# EasyEDA Pro project ProPrj_大功率电调_2026-08-17.epro, board 主控板
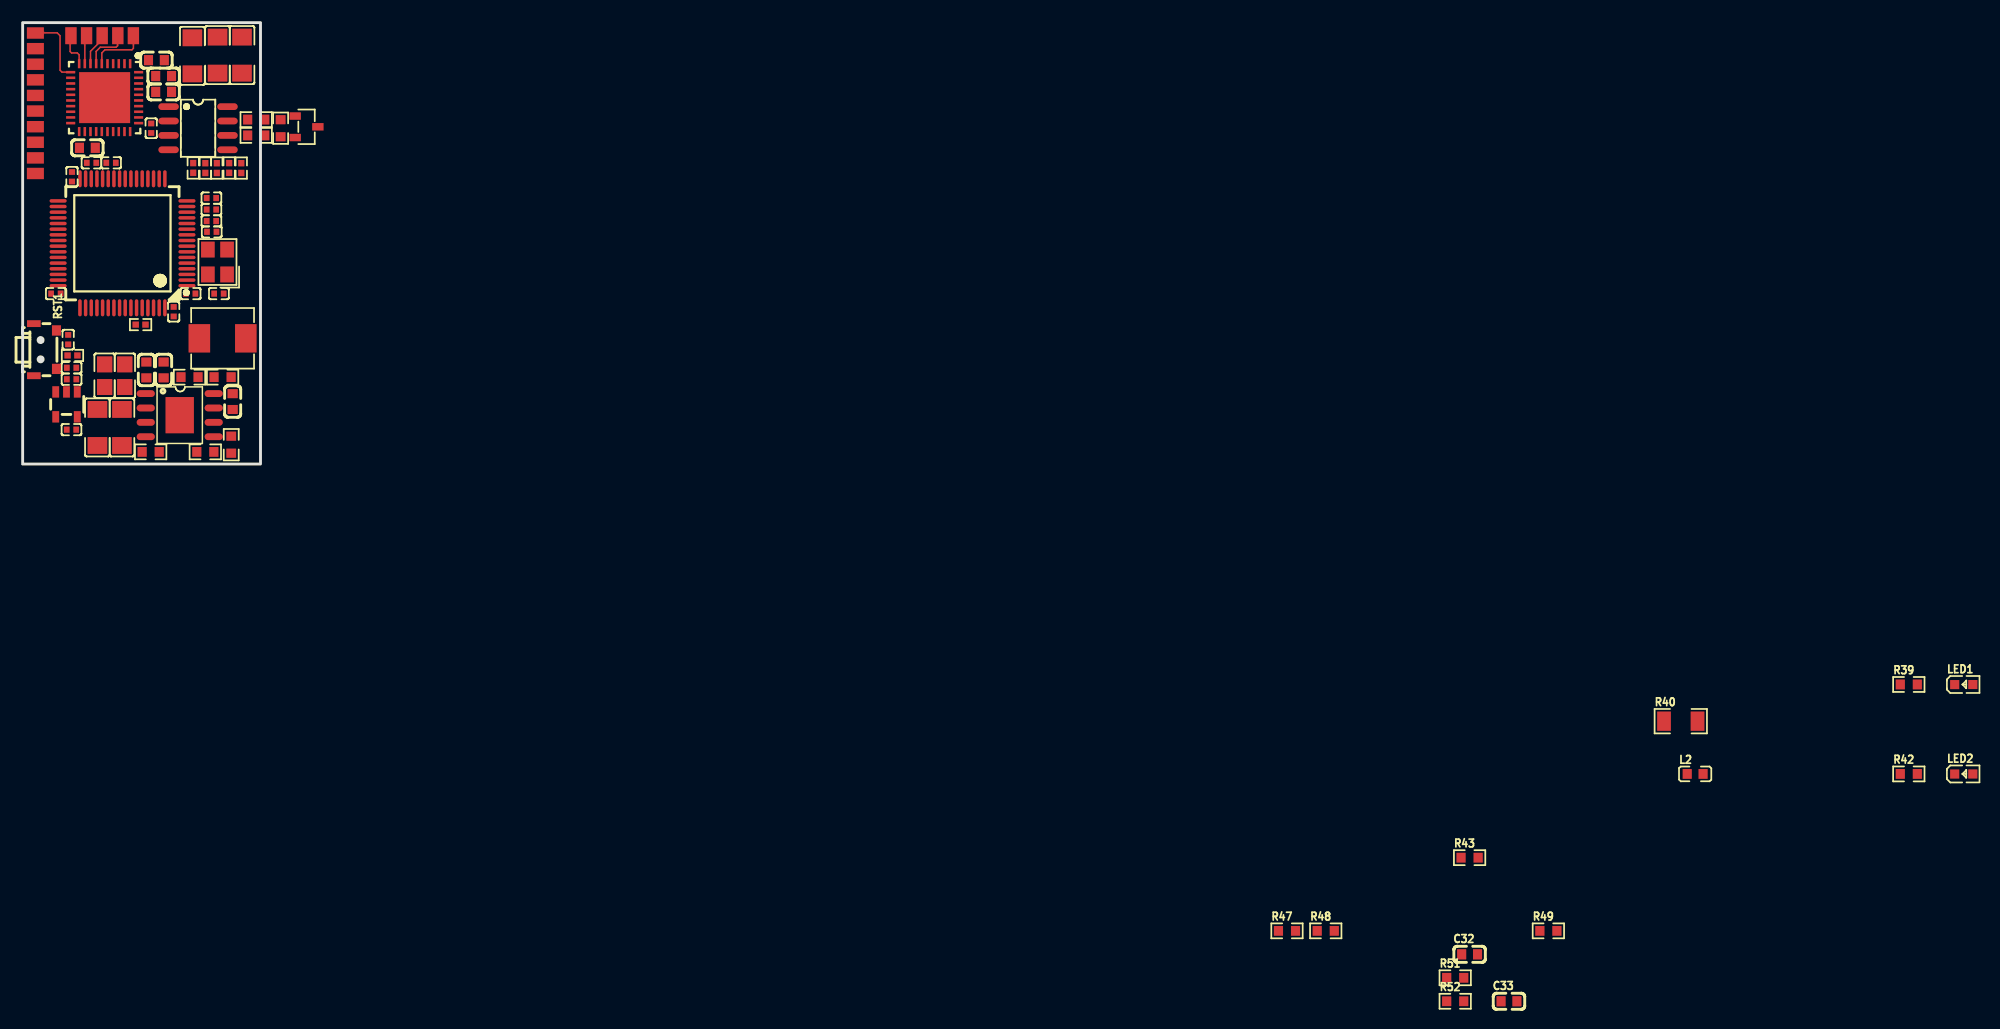
[diagram p25: board, top side]
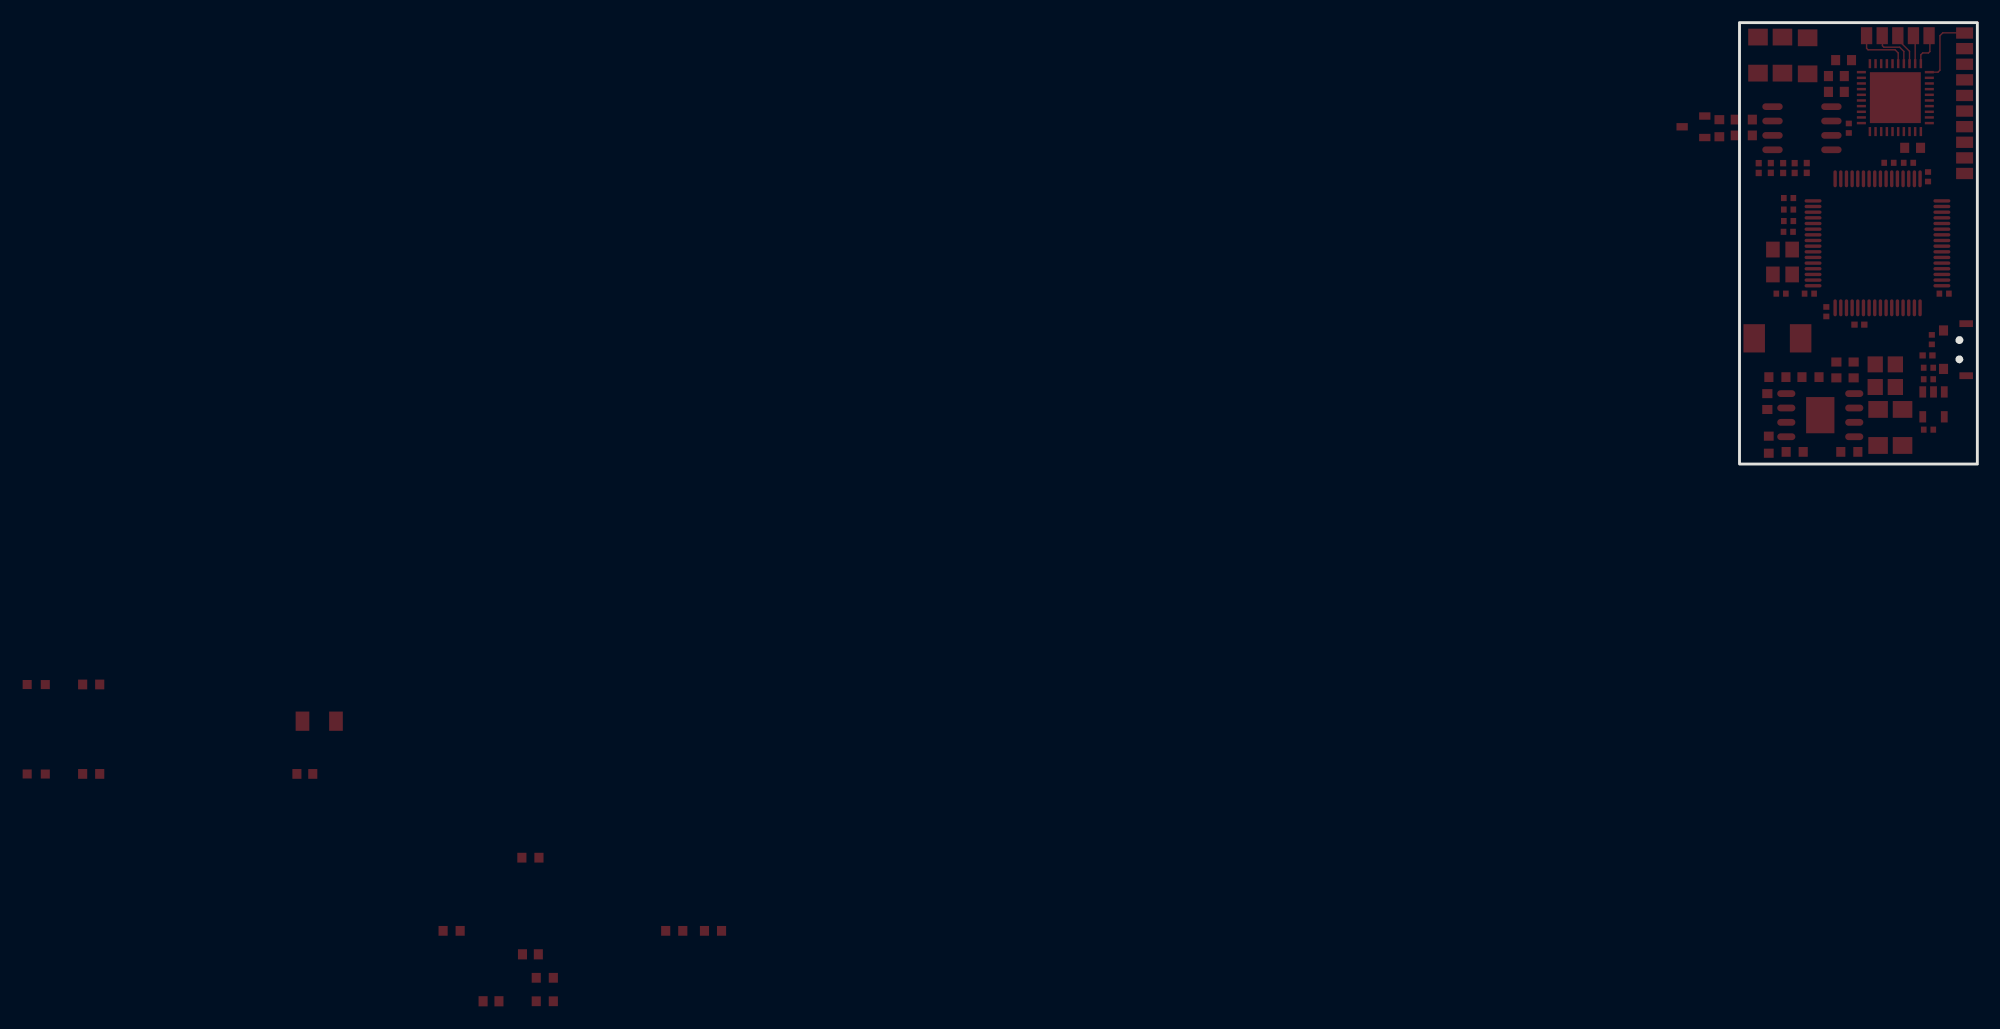
[diagram p26: board, bottom side, seen from below]

Outline 21 x 39 mm; copper layers: Top Layer, Bottom Layer. Coordinates in mm from the lower left corner of the outline.
Outline path: rectangle 0,39 21,0
Stack: Top Layer 0.035mm / Dielectric1 1.51mm FR4 er 4.5 / Bottom Layer 0.035mm

## Design rules (mm)
spacing copperThickness1oz (default): track to track 0.102, other pairs 0.152 to 0.3
spacing copperThickness2oz: track to track 0.203, other pairs 0.152 to 0.3
track width copperThickness1oz (default): min 0.127, default 0.127, max 2.54
track width copperThickness2oz: min 0.203, default 0.254, max 2.54
differential pair differentialPair (default): width min 0.127, default 0.254, max 2.54; gap min 0.152, default 0.152

## Placement (name value [footprint] x y rotation side)
C1  47nf  [C0603]  11.81 35.69 180 top
C2  10uF/100v  [C1206]  19.37 36.13 90 top
C3  100nF/100v  [C1206]  17.21 36.13 90 top
C4  1uF  [C1206]  14.99 36.07 270 top
C5  1uf  [C0603]  12.45 34.28 0 top
C6  1uf  [C0603]  12.45 32.88 0 top
C7  1nF  [C0402]  16.67 23.5 180 top
C8  1nF  [C0402]  16.67 22.49 180 top
C9  1nF  [C0402]  16.67 21.47 180 top
C10  2.2nF/50v  [C0603]  18.54 5.52 90 top
C11  22µF/16V  [C0805]  7.24 7.81 90 top
C12  22µF/16V  [C0805]  9.02 7.81 90 top
C13  2.2uf/100v  [C1206]  6.6 3.23 270 top
C14  100nF/100v  [C1206]  8.76 3.23 270 top
C15  3.3nf/50v  [C0603]  12.45 8.31 270 top
C16  150pf/50v  [C0603]  10.92 8.31 270 top
C17  1uF  [C0402]  4.32 8.51 0 top
C18  100nF  [C0402]  4.32 7.49 0 top
C19  1uF  [C0402]  4.31 3.04 0 top
C20  20pf  [C0402]  16.69 20.52 0 top
C21  100nF  [C0402]  13.34 13.46 90 top
C22  100nF  [C0402]  14.83 15.06 180 top
C23  100nF  [C0402]  2.93 15.06 0 top
C24  100nF  [C0402]  4.35 25.38 270 top
C25  100nF  [C0402]  6.08 26.61 0 top
C26  1uf  [C0603]  5.72 27.94 0 top
C27  100nF  [C0402]  7.8 26.61 180 top
C28  20pf  [C0402]  17.33 15.06 180 top
C29  100nF  [C0402]  4.02 10.99 270 top
C30  100nF  [C0402]  11.35 29.67 90 top
C32  10nF  [C0603]  127.76 -43.31 0 top
C33  100nF  [C0603]  131.23 -47.46 0 top
D1  PESD2CAN,215  [SOT-23-3_L2.9-W1.3-P1.90-LS2.4-BR]  25.06 29.8 180 top
L1  33uH  [IND-SMD_L5.4-W5.2]  17.65 11.11 0 top
L2  BLM18PG121SN1D  [L0603]  147.67 -27.38 0 top
LED1  -  [LED_0603]  171.44 -19.47 0 top
LED2  -  [LED_0603]  171.44 -27.38 0 top
NOREF  -  [Pad_e283]  1.12 36.7 90 top
NOREF#2  -  [Pad_e281]  1.12 33.95 90 top
NOREF#3  -  [Pad_e289]  1.12 28.43 90 top
NOREF#4  -  [Pad_e284]  1.12 29.81 90 top
NOREF#5  -  [Pad_e276]  8.4 37.85 0 top
NOREF#6  -  [Pad_e285]  1.12 31.19 90 top
NOREF#7  -  [Pad_e282]  1.12 35.32 90 top
NOREF#8  -  [Pad_e278]  1.12 38.08 90 top
NOREF#9  -  [Pad_e275]  9.78 37.85 0 top
NOREF#10  -  [Pad_e280]  5.64 37.85 0 top
NOREF#11  -  [Pad_e288]  1.12 27.05 90 top
NOREF#12  -  [Pad_e286]  1.12 32.57 90 top
NOREF#13  -  [Pad_e277]  7.02 37.85 0 top
NOREF#14  -  [Pad_e287]  1.12 25.67 90 top
NOREF#15  -  [Pad_e279]  4.26 37.85 0 top
R1  10K  [R0402]  4.4 9.6 180 top
R28  10K  [R0402]  19.3 26.15 90 top
R29  10K  [R0402]  18.24 26.16 90 top
R30  100  [R0402]  17.15 26.15 90 top
R31  100  [R0402]  16.13 26.15 90 top
R32  100  [R0402]  15.06 26.16 90 top
R33  68K  [R0603]  17.65 7.68 0 top
R34  158k  [R0603]  18.42 1.71 270 top
R35  68K  [R0603]  14.73 7.68 0 top
R36  49.9k  [R0603]  16.13 1.08 0 top
R37  31.6k  [R0603]  11.3 1.08 180 top
R38  10K  [R0402]  10.41 12.32 0 top
R39  10K  [R0603]  166.54 -19.47 0 top
R40  0  [R1206]  146.4 -22.72 0 top
R42  10K  [R0603]  166.54 -27.38 0 top
R43  100  [R0603]  127.76 -34.78 0 top
R44  5.1  [R0603]  20.62 30.43 0 top
R46  120  [R0603]  22.78 29.67 90 top
R47  330K  [R0603]  111.63 -41.24 0 top
R48  330K  [R0603]  115.06 -41.24 0 top
R49  36K  [R0603]  134.71 -41.24 0 top
R50  5.1  [R0603]  20.62 29.04 0 top
R51  10k  [R0603]  126.49 -45.39 0 top
R52  HNTC0603-103F3950FB  [R0603]  126.49 -47.46 0 top
RST1  侧按侧贴开关  [KEY-SMD_1TS003B]  1.99 10.11 270 top
U1  DRV8353SRTAR  [WQFN-40_L6.0-W6.0-P0.50-TL-EP4.5]  7.24 32.37 270 top
U2  STM32G474RCT6  [LQFP-64_L10.0-W10.0-P0.50-LS12.0-BL]  8.82 19.5 90 top
U3  LM5164DDAR  [SO-8_L4.9-W3.9-P1.27-LS6.0-BL-EP]  13.87 4.32 270 top
U4  SPX3819-3.3  [SOT-23-5_L2.9-W1.6-P0.95-LS2.8-BL]  3.87 5.27 180 top
U7  TCAN332DR  [SOIC-8_L4.9-W3.9-P1.27-LS6.0-BL]  15.49 29.67 270 top
X1  8MHz  [CRYSTAL-SMD_4P-L3.2-W2.5-BL]  17.2 17.85 90 top

## Footprints (pads in the part's own frame, mm; a bottom-side part is the same pattern mirrored in y, then rotated)
C0402
  rect 0.5x0.54 smd: 1(-0.42,0) 2(0.42,0)
C0603
  rect 0.8x0.9 smd: 1(-0.7,0) 2(0.7,0)
C0805
  rect 1.41x1.35 smd: 1(-1,0) 2(1,0)
C1206
  rect 1.485x1.728 smd: 1(-1.593,0) 2(1.593,0)
CRYSTAL-SMD_4P-L3.2-W2.5-BL
  rect 1.4x1.2 smd: 1(-1.1,-0.85) 2(1.1,-0.85) 3(1.1,0.85) 4(-1.1,0.85)
IND-SMD_L5.4-W5.2
  rect 1.9x2.5 smd: 1(2.05,0) 2(-2.05,0)
KEY-SMD_1TS003B
  rect 0.9x0.8 smd: 1(1.7,1) 2(-1.7,1)
  rect 0.6x1.2 smd: 3(-2.3,-1) 4(2.3,-1)
L0603
  rect 0.8x0.864 smd: 1(-0.7,0) 2(0.7,0)
LED_0603
  rect 0.8x0.8 smd: 1(-0.851,-0.01) 2(0.75,-0.005)
LQFP-64_L10.0-W10.0-P0.50-LS12.0-BL
  oval 0.3x1.5 smd: 1(-3.75,-5.688) 2(-3.25,-5.688) 3(-2.75,-5.688) 4(-2.25,-5.688) 5(-1.75,-5.688) 6(-1.25,-5.688) 7(-0.75,-5.688) 8(-0.25,-5.688) 9(0.25,-5.688) 10(0.75,-5.688) 11(1.25,-5.688) 12(1.75,-5.688) 13(2.25,-5.688) 14(2.75,-5.688) 15(3.25,-5.688) 16(3.75,-5.688) 33(3.75,5.688) 34(3.25,5.688) 35(2.75,5.688) 36(2.25,5.688) 37(1.75,5.688) 38(1.25,5.688) 39(0.75,5.688) 40(0.25,5.688) 41(-0.25,5.688) 42(-0.75,5.688) 43(-1.25,5.688) 44(-1.75,5.688) 45(-2.25,5.688) 46(-2.75,5.688) 47(-3.25,5.688) 48(-3.75,5.688)
  oval 1.5x0.3 smd: 17(5.7,-3.738) 18(5.7,-3.238) 19(5.7,-2.738) 20(5.7,-2.238) 21(5.7,-1.738) 22(5.7,-1.238) 23(5.7,-0.739) 24(5.7,-0.238) 25(5.7,0.262) 26(5.7,0.762) 27(5.7,1.262) 28(5.7,1.762) 29(5.7,2.261) 30(5.7,2.762) 31(5.7,3.261) 32(5.7,3.762) 49(-5.7,3.762) 50(-5.7,3.261) 51(-5.7,2.762) 52(-5.7,2.261) 53(-5.7,1.762) 54(-5.7,1.262) 55(-5.7,0.762) 56(-5.7,0.262) 57(-5.7,-0.238) 58(-5.7,-0.739) 59(-5.7,-1.238) 60(-5.7,-1.738) 61(-5.7,-2.238) 62(-5.7,-2.738) 63(-5.7,-3.238) 64(-5.7,-3.738)
Pad_e275
  rect 1x1.5 smd: 1(0,0)
Pad_e276
  rect 1x1.5 smd: 1(0,0)
Pad_e277
  rect 1x1.5 smd: 1(0,0)
Pad_e278
  rect 1x1.5 smd: 1(0,0)
Pad_e279
  rect 1x1.5 smd: 1(0,0)
Pad_e280
  rect 1x1.5 smd: 1(0,0)
Pad_e281
  rect 1x1.5 smd: 1(0,0)
Pad_e282
  rect 1x1.5 smd: 1(0,0)
Pad_e283
  rect 1x1.5 smd: 1(0,0)
Pad_e284
  rect 1x1.5 smd: 1(0,0)
Pad_e285
  rect 1x1.5 smd: 1(0,0)
Pad_e286
  rect 1x1.5 smd: 1(0,0)
Pad_e287
  rect 1x1.5 smd: 1(0,0)
Pad_e288
  rect 1x1.5 smd: 1(0,0)
Pad_e289
  rect 1x1.5 smd: 1(0,0)
R0402
  rect 0.566x0.54 smd: 1(-0.433,0) 2(0.433,0)
R0603
  rect 0.806x0.864 smd: 1(-0.753,0) 2(0.753,0)
R1206
  rect 1.208x1.701 smd: 1(-1.479,0) 2(1.479,0)
SO-8_L4.9-W3.9-P1.27-LS6.0-BL-EP
  oval 0.6x1.6 smd: 1(-1.905,-3) 2(-0.635,-3) 3(0.635,-3) 4(1.905,-3) 5(1.905,3) 6(0.635,3) 7(-0.635,3) 8(-1.905,3)
  rect 3.2x2.5 smd: 9(0,0)
SOIC-8_L4.9-W3.9-P1.27-LS6.0-BL
  oval 0.588x1.8 smd: 1(-1.905,-2.6) 2(-0.635,-2.6) 3(0.635,-2.6) 4(1.905,-2.6) 5(1.905,2.6) 6(0.635,2.6) 7(-0.635,2.6) 8(-1.905,2.6)
SOT-23-3_L2.9-W1.3-P1.90-LS2.4-BR
  rect 1x0.65 smd: 1(1,-0.95) 2(1,0.95) 3(-1,0)
SOT-23-5_L2.9-W1.6-P0.95-LS2.8-BL
  rect 0.6x1 smd: 1(-0.95,-1.1) 2(0,-1.1) 3(0.95,-1.1) 4(0.95,1.1) 5(-0.95,1.1)
WQFN-40_L6.0-W6.0-P0.50-TL-EP4.5
  rect 0.8x0.22 smd: 1(-3,2.25) 2(-3,1.75) 3(-3,1.25) 4(-3,0.75) 5(-3,0.25) 6(-3,-0.25) 7(-3,-0.75) 8(-3,-1.25) 9(-3,-1.75) 10(-3,-2.25) 21(3,-2.25) 22(3,-1.75) 23(3,-1.25) 24(3,-0.75) 25(3,-0.25) 26(3,0.25) 27(3,0.75) 28(3,1.25) 29(3,1.75) 30(3,2.25)
  rect 0.22x0.8 smd: 11(-2.25,-3) 12(-1.75,-3) 13(-1.25,-3) 14(-0.75,-3) 15(-0.25,-3) 16(0.25,-3) 17(0.75,-3) 18(1.25,-3) 19(1.75,-3) 20(2.25,-3) 31(2.25,3) 32(1.75,3) 33(1.25,3) 34(0.75,3) 35(0.25,3) 36(-0.25,3) 37(-0.75,3) 38(-1.25,3) 39(-1.75,3) 40(-2.25,3)
  rect 4.5x4.5 smd: 41(0,0)

## Nets
As in the schematic, except:
GHA: NOREF#9.1 U1.6
GHB: NOREF#12.1 U1.15
GHC: NOREF#6.1 U1.16
GLA: NOREF#13.1 U1.8
GLB: NOREF#7.1 U1.13
GLC: NOREF#3.1 U1.18
SNA: NOREF#15.1 U1.10
SNB: NOREF#8.1 U1.11
SNC: NOREF#14.1 U1.20
SPA: NOREF#10.1 U1.9
SPB: NOREF.1 U1.12
SPC: NOREF#11.1 U1.19
U: NOREF#5.1 U1.7
V: NOREF#2.1 U1.14
W: NOREF#4.1 U1.17

Pads without a net: RST1 3 4; U3 6; U4 4; U7 5 8

## Routing (per net, layer and track width the routed paths; a pad name or vN(x,y) marks a point on that pad's centre or on a via; arc(x,y) is an arc through that point)
GHA: length 5
  Top Layer w0.127: U1.6 6.99,36.33 7.26,36.6 9.65,36.6 9.78,36.73 NOREF#9.1
GLA: length 2.9
  Top Layer w0.127: NOREF#13.1 6.99,37.81 6.99,37.47 5.99,36.47 U1.8
SNA: length 3.1
  Top Layer w0.127: NOREF#15.1 4.19,37.77 4.19,36.45 4.32,36.32 4.83,36.32 4.99,36.16 U1.10
SNB: length 6.3
  Top Layer w0.127: U1.11 3.48,34.62 3.3,34.8 3.3,37.85 3.05,38.1 1.14,38.1 NOREF#8.1
SPA: length 2.5
  Top Layer w0.127: NOREF#10.1 5.49,37.69 U1.9
U: length 4.1
  Top Layer w0.127: U1.7 6.49,36.46 6.86,36.83 8.25,36.83 8.38,36.96 8.38,37.83 NOREF#5.1

Small or netless copper shapes (teardrops, artwork), in the pictures only: 12 on Top Layer
